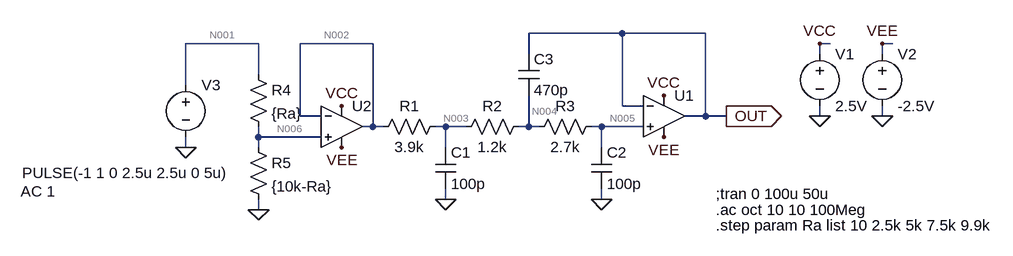
[diagram p0: schematic 3rd VCVS with POT Buffer.asc]
3rd VCVS with POT Buffer.asc, the LTspice schematic file:
Version 4
SHEET 1 1076 680
WIRE 432 -64 288 -64
WIRE 560 -64 432 -64
WIRE -128 -48 -240 -48
WIRE 48 -48 -64 -48
WIRE 752 -48 736 -48
WIRE 848 -48 832 -48
WIRE 288 -32 288 -64
WIRE 736 -32 736 -48
WIRE 832 -32 832 -48
WIRE -128 0 -128 -48
WIRE -240 16 -240 -48
WIRE 432 48 432 -64
WIRE 464 48 432 48
WIRE -64 64 -64 -48
WIRE -32 64 -64 64
WIRE 560 64 560 -64
WIRE 560 64 528 64
WIRE 592 64 560 64
WIRE 736 64 736 48
WIRE 832 64 832 48
WIRE 48 80 48 -48
WIRE 48 80 32 80
WIRE 64 80 48 80
WIRE 160 80 144 80
WIRE 192 80 160 80
WIRE 288 80 288 32
WIRE 288 80 272 80
WIRE 304 80 288 80
WIRE 400 80 384 80
WIRE 464 80 400 80
WIRE -128 96 -128 80
WIRE -32 96 -128 96
WIRE -240 112 -240 96
WIRE -128 112 -128 96
WIRE 160 112 160 80
WIRE 400 112 400 80
WIRE 160 192 160 176
WIRE 400 192 400 176
WIRE -128 208 -128 192
FLAG 400 192 0
FLAG 160 192 0
FLAG 736 64 0
FLAG 832 64 0
FLAG 736 -48 VCC
FLAG 832 -48 VEE
FLAG 496 32 VCC
FLAG 496 96 VEE
FLAG 592 64 OUT
IOPIN 592 64 Out
FLAG -240 112 0
FLAG -128 208 0
FLAG 0 48 VCC
FLAG 0 112 VEE
SYMBOL res 160 64 R90
WINDOW 0 0 56 VBottom 2
WINDOW 3 32 56 VTop 2
SYMATTR InstName R1
SYMATTR Value 3.9k
SYMBOL res 288 64 R90
WINDOW 0 0 56 VBottom 2
WINDOW 3 32 56 VTop 2
SYMATTR InstName R2
SYMATTR Value 1.2k
SYMBOL res 400 64 R90
WINDOW 0 0 56 VBottom 2
WINDOW 3 32 56 VTop 2
SYMATTR InstName R3
SYMATTR Value 2.7k
SYMBOL cap 144 112 R0
SYMATTR InstName C1
SYMATTR Value 100p
SYMBOL cap 384 112 R0
SYMATTR InstName C2
SYMATTR Value 100p
SYMBOL Opamps\\UniversalOpamp2 496 64 R0
SYMATTR InstName U1
SYMBOL cap 272 -32 R0
SYMATTR InstName C3
SYMATTR Value 470p
SYMBOL voltage 736 -48 R0
WINDOW 123 0 0 Left 2
WINDOW 39 0 0 Left 2
SYMATTR InstName V1
SYMATTR Value 2.5V
SYMBOL voltage 832 -48 R0
SYMATTR InstName V2
SYMATTR Value -2.5V
SYMBOL voltage -240 0 R0
WINDOW 3 -252 151 Left 2
WINDOW 123 -254 180 Left 2
WINDOW 39 0 0 Left 2
SYMATTR InstName V3
SYMATTR Value PULSE(-1 1 0 2.5u 2.5u 0 5u)
SYMATTR Value2 AC 1
SYMBOL Opamps\\UniversalOpamp2 0 80 R0
SYMATTR InstName U2
SYMBOL res -144 -16 R0
SYMATTR InstName R4
SYMATTR Value {Ra}
SYMBOL res -144 96 R0
SYMATTR InstName R5
SYMATTR Value {10k-Ra}
TEXT 576 184 Left 2 !;tran 0 100u 50u
TEXT 576 208 Left 2 !.ac oct 10 10 100Meg
TEXT 576 232 Left 2 !.step param Ra list 10 2.5k 5k 7.5k 9.9k

The netlist it stands for:
* 3rd VCVS with POT Buffer.asc
R1 N003 N002 3.9k
R2 N004 N003 1.2k
R3 N005 N004 2.7k
C1 N003 0 100p
C2 N005 0 100p
XU1 N005 OUT VCC VEE OUT level.2 Avol=1Meg GBW=10Meg Slew=10Meg ilimit=25m rail=0 Vos=0 phimargin=45 en=0 enk=0 in=0 ink=0 Rin=500Meg  ; pins IN+ IN- V+ V- OUT
C3 OUT N004 470p
V1 VCC 0 2.5V
V2 VEE 0 -2.5V
V3 N001 0 PULSE(-1 1 0 2.5u 2.5u 0 5u) AC 1
XU2 N006 N002 VCC VEE N002 level.2 Avol=1Meg GBW=10Meg Slew=10Meg ilimit=25m rail=0 Vos=0 phimargin=45 en=0 enk=0 in=0 ink=0 Rin=500Meg  ; pins IN+ IN- V+ V- OUT
R4 N001 N006 {Ra}
R5 N006 0 {10k-Ra}
;tran 0 100u 50u
.ac oct 10 10 100Meg
.step param Ra list 10 2.5k 5k 7.5k 9.9k
.lib UniversalOpamps2.sub
.backanno
.end

* Results of the author's LTspice run, read from the files saved beside the schematic
* Operating Point (first step), zero values left out:
*   ra = 10 
*   V(n003) = -999 mV
*   V(n002) = -999 mV
*   V(n004) = -999 mV
*   V(n005) = -999 mV
*   V(out) = -999 mV
*   V(vcc) = 2.5 V
*   V(vee) = -2.5 V
*   V(n001) = -1 V
*   V(n006) = -999 mV
*   I(R5) = -100 µA
*   I(R4) = -100 µA
*   I(R3) = 1.998 nA
*   I(R2) = 1.998 nA
*   I(R1) = 1.998 nA
*   I(V3) = 100 µA
*   I(V2) = 458.4 µA
*   I(V1) = -458.4 µA
*   Ix(u1:1) = -1.998 nA
*   Ix(u1:2) = -1.998 nA
*   Ix(u1:3) = 229.2 µA
*   Ix(u1:4) = -229.2 µA
*   Ix(u1:5) = 1.998 nA
*   Ix(u2:1) = -1.998 nA
*   Ix(u2:2) = -1.998 nA
*   Ix(u2:3) = 229.2 µA
*   Ix(u2:4) = -229.2 µA
*   Ix(u2:5) = 3.996 nA
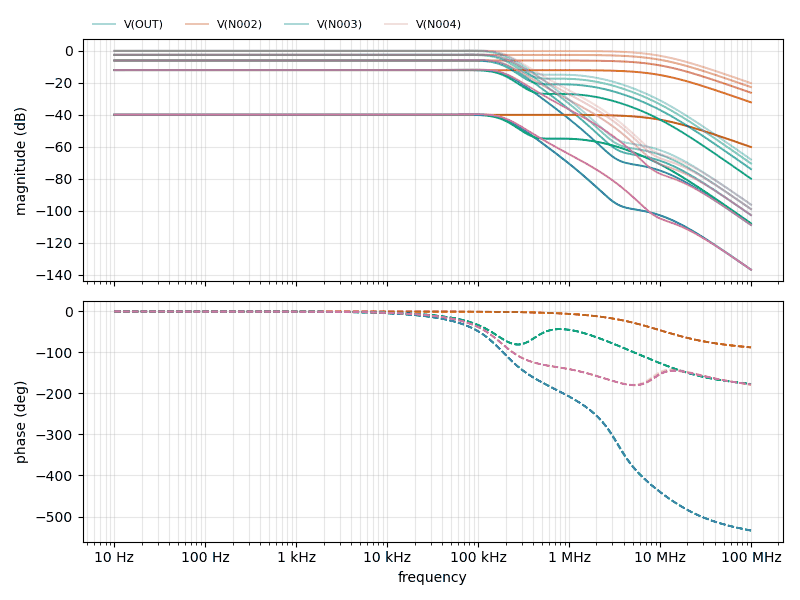
[diagram p1: AC Analysis of 3rd VCVS with POT Buffer.asc, plotted from the saved traces]
* AC Analysis, 5 runs:
*   V(OUT) [run 1]: -0.01 dB at 10 Hz, -96.20 dB at 100 MHz, peak 0.18 dB at 81.92 kHz, 3 dB below the peak at 199.7 kHz
*   V(OUT) [run 2]: -2.50 dB at 10 Hz, -99.04 dB at 100 MHz, peak -2.31 dB at 81.92 kHz, 3 dB below the peak at 199.7 kHz
*   V(OUT) [run 3]: -6.02 dB at 10 Hz, -102.79 dB at 100 MHz, peak -5.83 dB at 81.92 kHz, 3 dB below the peak at 199.7 kHz
*   V(OUT) [run 4]: -12.04 dB at 10 Hz, -108.95 dB at 100 MHz, peak -11.85 dB at 81.92 kHz, 3 dB below the peak at 199.7 kHz
*   V(OUT) [run 5]: -40.00 dB at 10 Hz, -136.95 dB at 100 MHz, peak -39.81 dB at 81.92 kHz, 3 dB below the peak at 199.7 kHz
*   V(N002) [run 1]: -0.01 dB at 10 Hz, -20.22 dB at 100 MHz, peak -0.01 dB at 133.1 kHz, 3 dB below the peak at 9.831 MHz
*   V(N002) [run 2]: -2.50 dB at 10 Hz, -22.70 dB at 100 MHz, peak -2.50 dB at 124.2 kHz, 3 dB below the peak at 9.842 MHz
*   V(N002) [run 3]: -6.02 dB at 10 Hz, -26.21 dB at 100 MHz, peak -6.02 dB at 124.2 kHz, 3 dB below the peak at 9.849 MHz
*   V(N002) [run 4]: -12.04 dB at 10 Hz, -32.23 dB at 100 MHz, peak -12.04 dB at 124.2 kHz, 3 dB below the peak at 9.852 MHz
*   V(N002) [run 5]: -40.00 dB at 10 Hz, -60.19 dB at 100 MHz, peak -40.00 dB at 124.2 kHz, 3 dB below the peak at 9.854 MHz
*   V(N003) [run 1]: -0.01 dB at 10 Hz, -68.00 dB at 100 MHz, peak 0.03 dB at 57.93 kHz, 3 dB below the peak at 185.3 kHz
*   V(N003) [run 2]: -2.50 dB at 10 Hz, -70.48 dB at 100 MHz, peak -2.46 dB at 57.93 kHz, 3 dB below the peak at 185.3 kHz
*   V(N003) [run 3]: -6.02 dB at 10 Hz, -74.00 dB at 100 MHz, peak -5.98 dB at 57.93 kHz, 3 dB below the peak at 185.3 kHz
*   V(N003) [run 4]: -12.04 dB at 10 Hz, -80.01 dB at 100 MHz, peak -12.00 dB at 57.93 kHz, 3 dB below the peak at 185.3 kHz
*   V(N003) [run 5]: -40.00 dB at 10 Hz, -107.97 dB at 100 MHz, peak -39.96 dB at 57.93 kHz, 3 dB below the peak at 185.3 kHz
*   V(N004) [run 1]: -0.01 dB at 10 Hz, -96.20 dB at 100 MHz, peak 0.27 dB at 94.1 kHz, 3 dB below the peak at 207.3 kHz
*   V(N004) [run 2]: -2.50 dB at 10 Hz, -99.04 dB at 100 MHz, peak -2.22 dB at 94.1 kHz, 3 dB below the peak at 207.3 kHz
*   V(N004) [run 3]: -6.02 dB at 10 Hz, -102.79 dB at 100 MHz, peak -5.74 dB at 94.1 kHz, 3 dB below the peak at 207.3 kHz
*   V(N004) [run 4]: -12.04 dB at 10 Hz, -108.95 dB at 100 MHz, peak -11.76 dB at 94.1 kHz, 3 dB below the peak at 207.3 kHz
*   V(N004) [run 5]: -40.00 dB at 10 Hz, -136.95 dB at 100 MHz, peak -39.72 dB at 94.1 kHz, 3 dB below the peak at 207.3 kHz